# EAGLE design KENDALI POMPA AIR IOT (EAGLE 7.4.0)
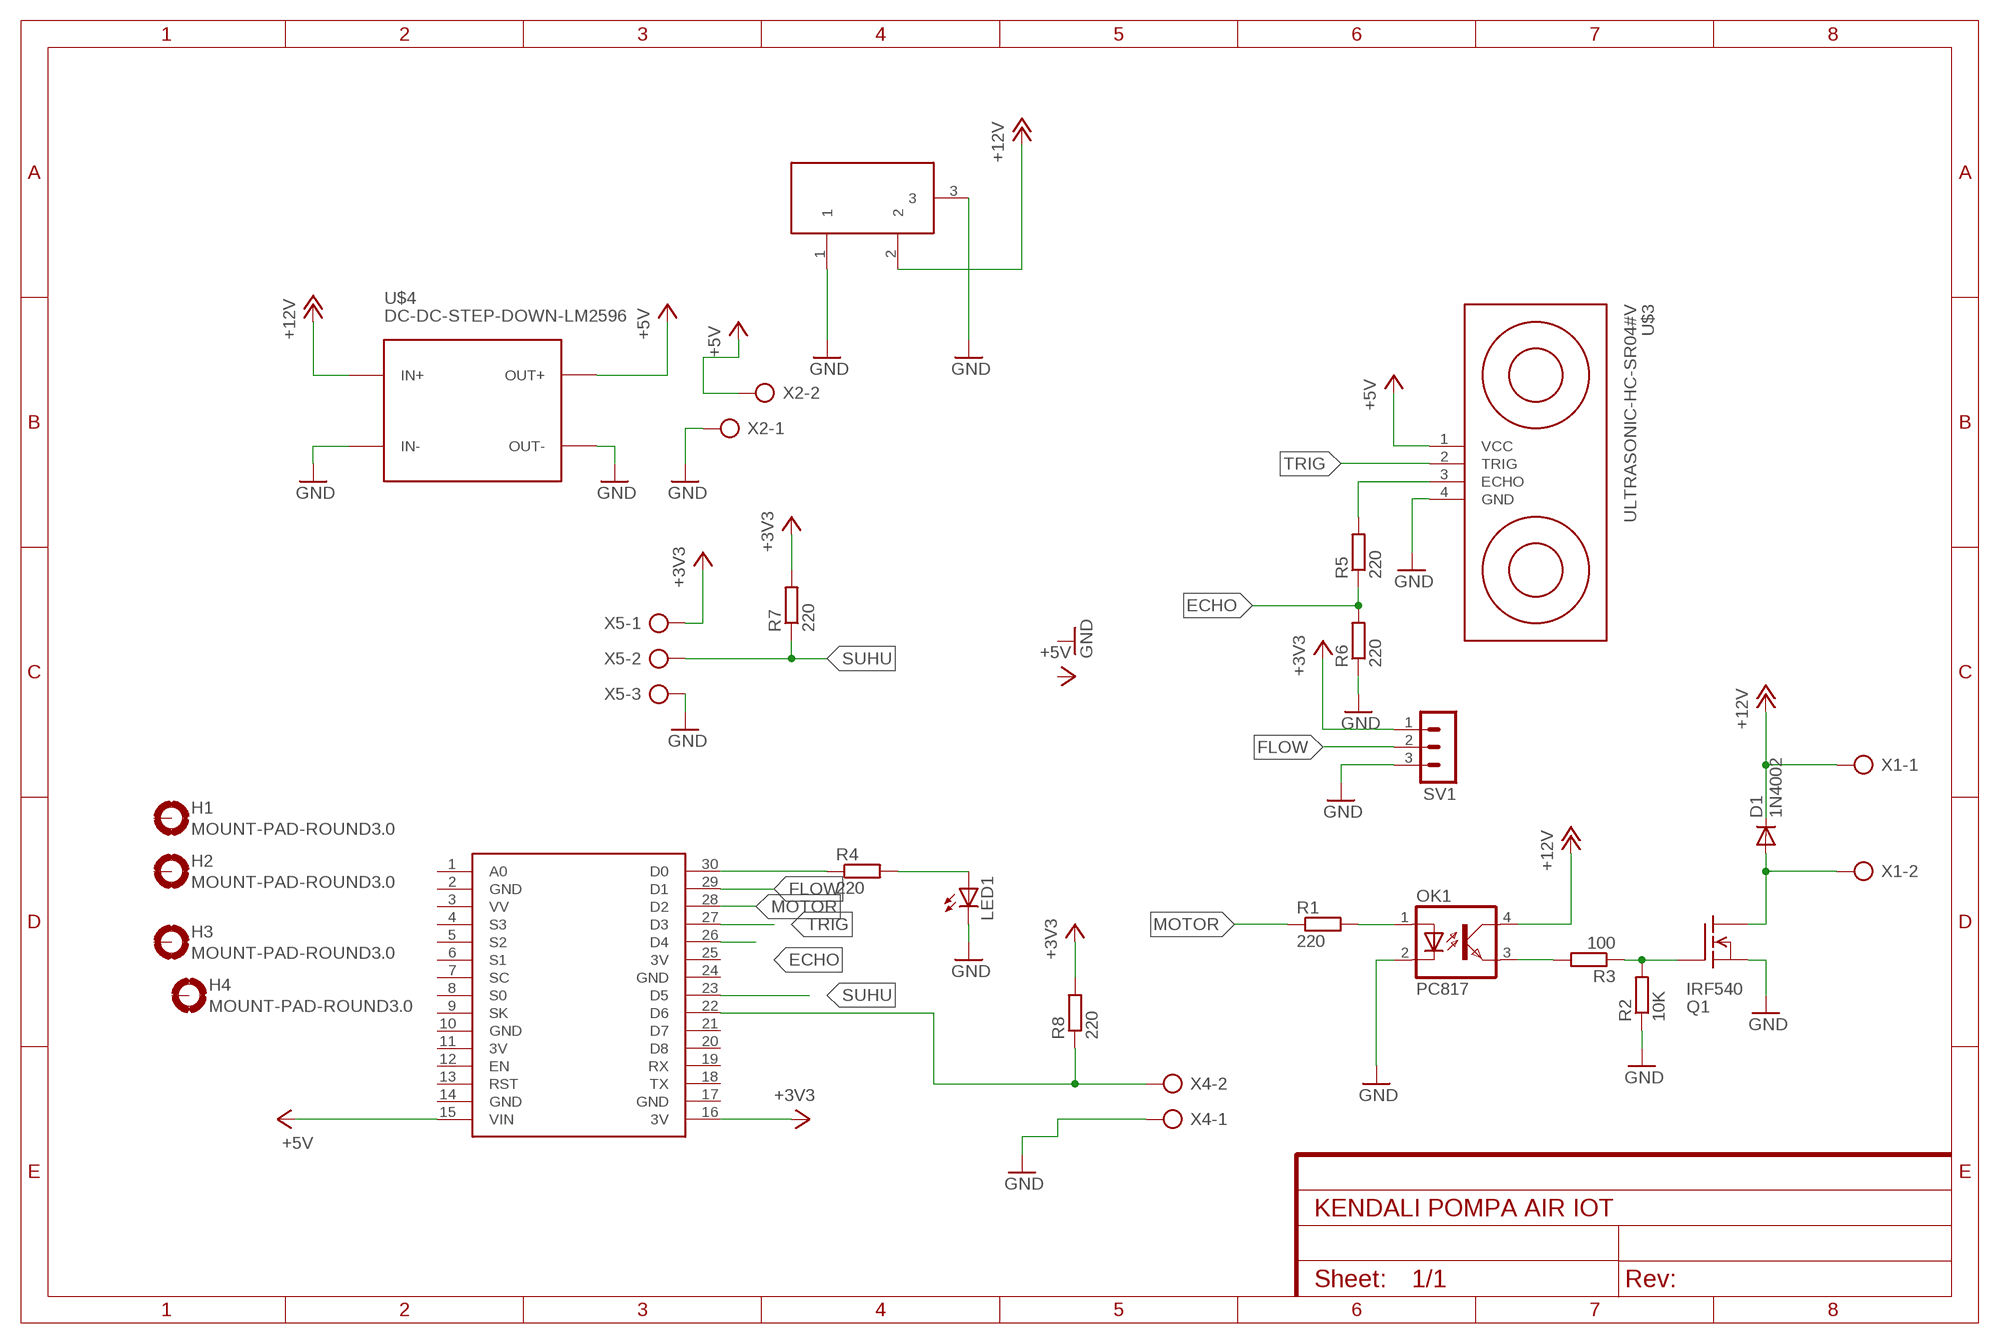
[diagram p0: schematic, sheet 1]

## Parts
D1  1N4002  1N4446  [DO35-10]
H1  MOUNT-PAD-ROUND3.0  [3,0-PAD]
H2  MOUNT-PAD-ROUND3.0  [3,0-PAD]
H3  MOUNT-PAD-ROUND3.0  [3,0-PAD]
H4  MOUNT-PAD-ROUND3.0  [3,0-PAD]
LED1  LED5MM  [LED5MM]
OK1  PC817  [DIL04]
Q1  IRF540  [TO220]
R1  220  R-EU_0207/10  [0207/10]
R2  10K  R-EU_0207/10  [0207/10]
R3  100  R-EU_0207/10  [0207/10]
R4  220  R-EU_0207/10  [0207/10]
R5  220  R-EU_0207/10  [0207/10]
R6  220  R-EU_0207/10  [0207/10]
R7  220  R-EU_0207/10  [0207/10]
R8  220  R-EU_0207/10  [0207/10]
SV1  MA03-1  [MA03-1]
U$1  NODEMCU  [NODEMCU]
U$2  DC21MMX  [DC-21MM]
U$3  ULTRASONIC-HC-SR04#V  [ULTRASONIC-HC-SR04#V]
U$4  DC-DC-STEP-DOWN-LM2596  [DC-DC-STEP-DOWN-LM2596]
X1  AK300/2  [AK300/2]
X2  AK300/2  [AK300/2]
X4  AK300/2  [AK300/2]
X5  AK300/3  [AK300/3]

## Nets
+3V3: R7.2 R8.2 SV1.1 U$1.16(3V) X5.1
+5V: U$1.15(VIN) U$3.1(VCC) U$4.OUT+ X2.2
+12V: D1.C OK1.4(COL) U$2.2 U$4.IN+ X1.1
ECHO: R5.1 R6.2 U$1.26(D4)
FLOW: SV1.2 U$1.29(D1)
GND: LED1.K(C) OK1.2(C) Q1.3(S) R2.1 R6.1 SV1.3 U$2.1 U$2.3 U$3.4(GND) U$4.IN- U$4.OUT- X2.1 X4.1 X5.3
MOTOR: R1.1 U$1.28(D2)
N$1: OK1.3(EMIT) R3.2
N$2: OK1.1(A) R1.2
N$3: Q1.1(G) R2.2 R3.1
N$4: D1.A Q1.2(D) X1.2
N$6: LED1.A R4.2
N$7: R8.1 U$1.22(D6) X4.2
N$10: R4.1 U$1.30(D0)
N$12: R5.2 U$3.3(ECHO)
SUHU: R7.1 U$1.23(D5) X5.2
TRIG: U$1.27(D3) U$3.2(TRIG)
Unconnected: H1.B3,0(MOUNT) H2.B3,0(MOUNT) H3.B3,0(MOUNT) H4.B3,0(MOUNT) U$1.1(A0) U$1.3(VV) U$1.4(S3) U$1.5(S2) U$1.6(S1) U$1.7(SC) U$1.8(S0) U$1.9(SK) U$1.12(EN) U$1.13(RST) U$1.18(TX) U$1.19(RX) U$1.20(D8) U$1.21(D7)

## Power pins joined to a net without a drawn wire
+3V3: U$1.11(3V) U$1.25(3V)
GND: U$1.2(GND) U$1.10(GND) U$1.14(GND) U$1.17(GND) U$1.24(GND)

## Library data of the parts
D1 = diode:1N4446: DIODE high speed (Philips)
H1-H4 = holes:MOUNT-PAD-ROUND: MOUNTING PAD, round
LED1 = led:LED: LED OSRAM: - CHIPLED LG R971, LG N971, LY N971, LG Q971, LY Q971, LO R971, LY R971 LH N974, LH R974 LS Q976, LO Q976, LY Q976 LO Q996 - Hyper CHIPLED LW Q18S LB Q993, LB Q99A, LB R99A - SideLED LS A670, LO A670, LY A670, LG A670, LP A670 LB A673, LV A673, LT A673, LW A673 LH A674 LY A675 LS A676, LA A676, LO A676, LY A676, LW A676 LS A679, LY A679, LG A679 - Hyper Micro SIDELED® LS Y876, LA Y876, LO Y876, LY Y876 LT Y87S - SmartLED LW L88C, LW L88S LB L89C, LB L89S, LG L890 LS L89K, LO L89K, LY L89K LS L896, LA L896, LO L896, LY L896 - TOPLED LS T670, LO T670, LY T670, LG T670, LP T670 LSG T670, LSP T670, LSY T670, LOP T670, LYG T670 LG T671, LOG T671, LSG T671 LB T673, LV T673, LT T673, LW T673 LH T674 LS T676, LA T676, LO T676, LY T676, LB T676, LH T676, LSB T676, LW T676 LB T67C, LV T67C, LT T67C, LS T67K, LO T67K, LY T67K, LW E67C LS E67B, LA E67B, LO E67B, LY E67B, LB E67C, LV E67C, LT E67C LW T67C LS T679, LY T679, LG T679 LS T770, LO T770, LY T770, LG T770, LP T770 LB T773, LV T773, LT T773, LW T773 LH T774 LS E675, LA E675, LY E675, LS T675 LS T776, LA T776, LO T776, LY T776, LB T776 LHGB T686 LT T68C, LB T68C - Hyper Mini TOPLED® LB M676 - Mini TOPLED Santana® LG M470 LS M47K, LO M47K, LY M47K Source: http://www.osram.convergy.de LUXEON: - LUMILED® LXK2-PW12-R00, LXK2-PW12-S00, LXK2-PW14-U00, LXK2-PW14-V00 LXK2-PM12-R00, LXK2-PM12-S00, LXK2-PM14-U00 LXK2-PE12-Q00, LXK2-PE12-R00, LXK2-PE12-S00, LXK2-PE14-T00, LXK2-PE14-U00 LXK2-PB12-K00, LXK2-PB12-L00, LXK2-PB12-M00, LXK2-PB14-N00, LXK2-PB14-P00, LXK2-PB14-Q00 LXK2-PR12-L00, LXK2-PR12-M00, LXK2-PR14-Q00, LXK2-PR14-R00 LXK2-PD12-Q00, LXK2-PD12-R00, LXK2-PD12-S00 LXK2-PH12-R00, LXK2-PH12-S00 LXK2-PL12-P00, LXK2-PL12-Q00, LXK2-PL12-R00 Source: www.luxeon.com KINGBRIGHT: KA-3528ASYC Source: www.kingbright.com
OK1 = optocoupler:PC817: SHARP OPTO COUPLER; MPN: PC817X4J000F; OC_FARNELL: 9707727; OC_NEWARK: 97K7059
Q1 = transistor-fet:IRF540: N-Channel Enhancement MOSFET (HEXFET); 100V; 28A; 0,077Ohm
R1-R8 = rcl:R-EU_: RESISTOR, European symbol
SV1 = con-lstb:MA03-1: PIN HEADER; OC_FARNELL: unknown; OC_NEWARK: unknown
U$1 = nodemcu:NODEMCU
U$2 = powersupply:DC21MM
U$3 = diy-modules:ULTRASONIC-HC-SR04: Ultrasonic Ranging Module HC-SR04 More details available here: http://randomnerdtutorials.com/complete-guide-for-ultrasonic-sensor-hc-sr04/ Click here to find device on ebay.com <http://www.ebay.com/sch/hc+sr04+ultrasonic>
U$4 = diy-modules:DC-DC-STEP-DOWN-LM2596: DC/DC Step-Down Regulator based on LM2596-ADJ chip LM2596 datasheet available here: http://www.ti.com/lit/ds/symlink/lm2596.pdf Click here to find device on ebay.com <http://www.ebay.com/sch/lm2596+power+regulator>
X1 X2 X4 = con-ptr500:AK300/2: CONNECTOR; OC_FARNELL: unknown; OC_NEWARK: unknown
X5 = con-ptr500:AK300/3: CONNECTOR; OC_FARNELL: unknown; OC_NEWARK: unknown

## Board
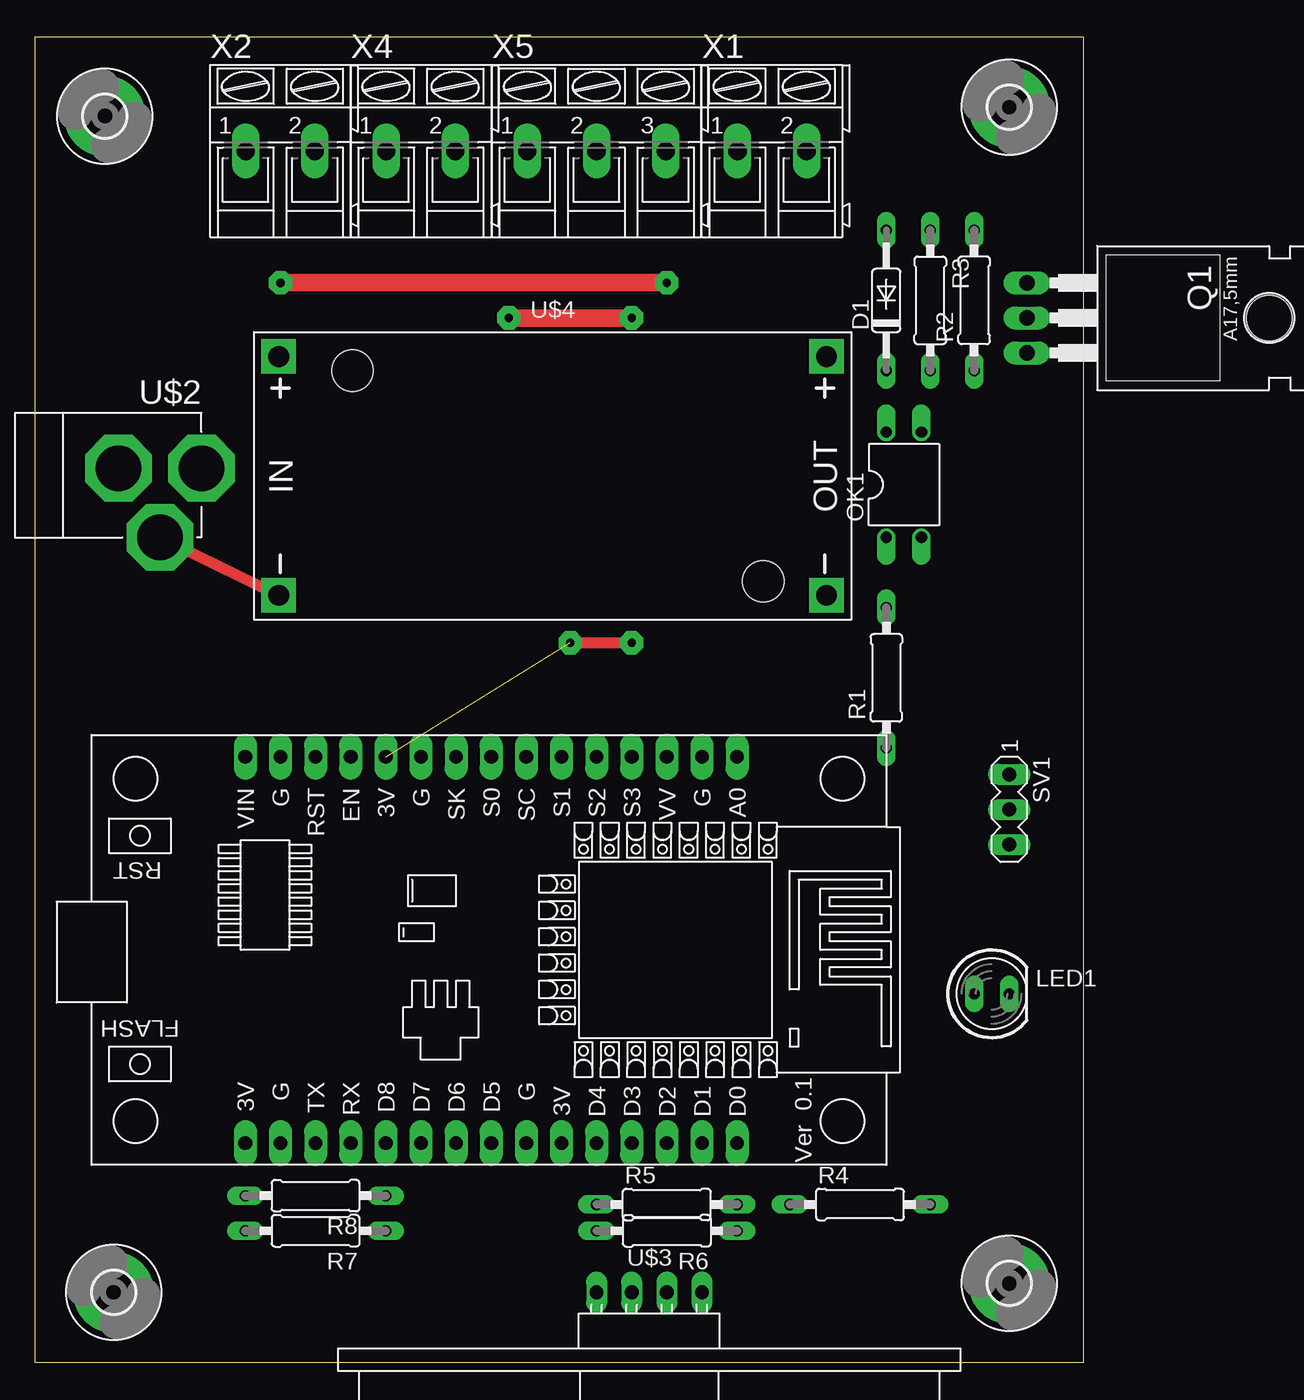
[diagram p1: board, top side]
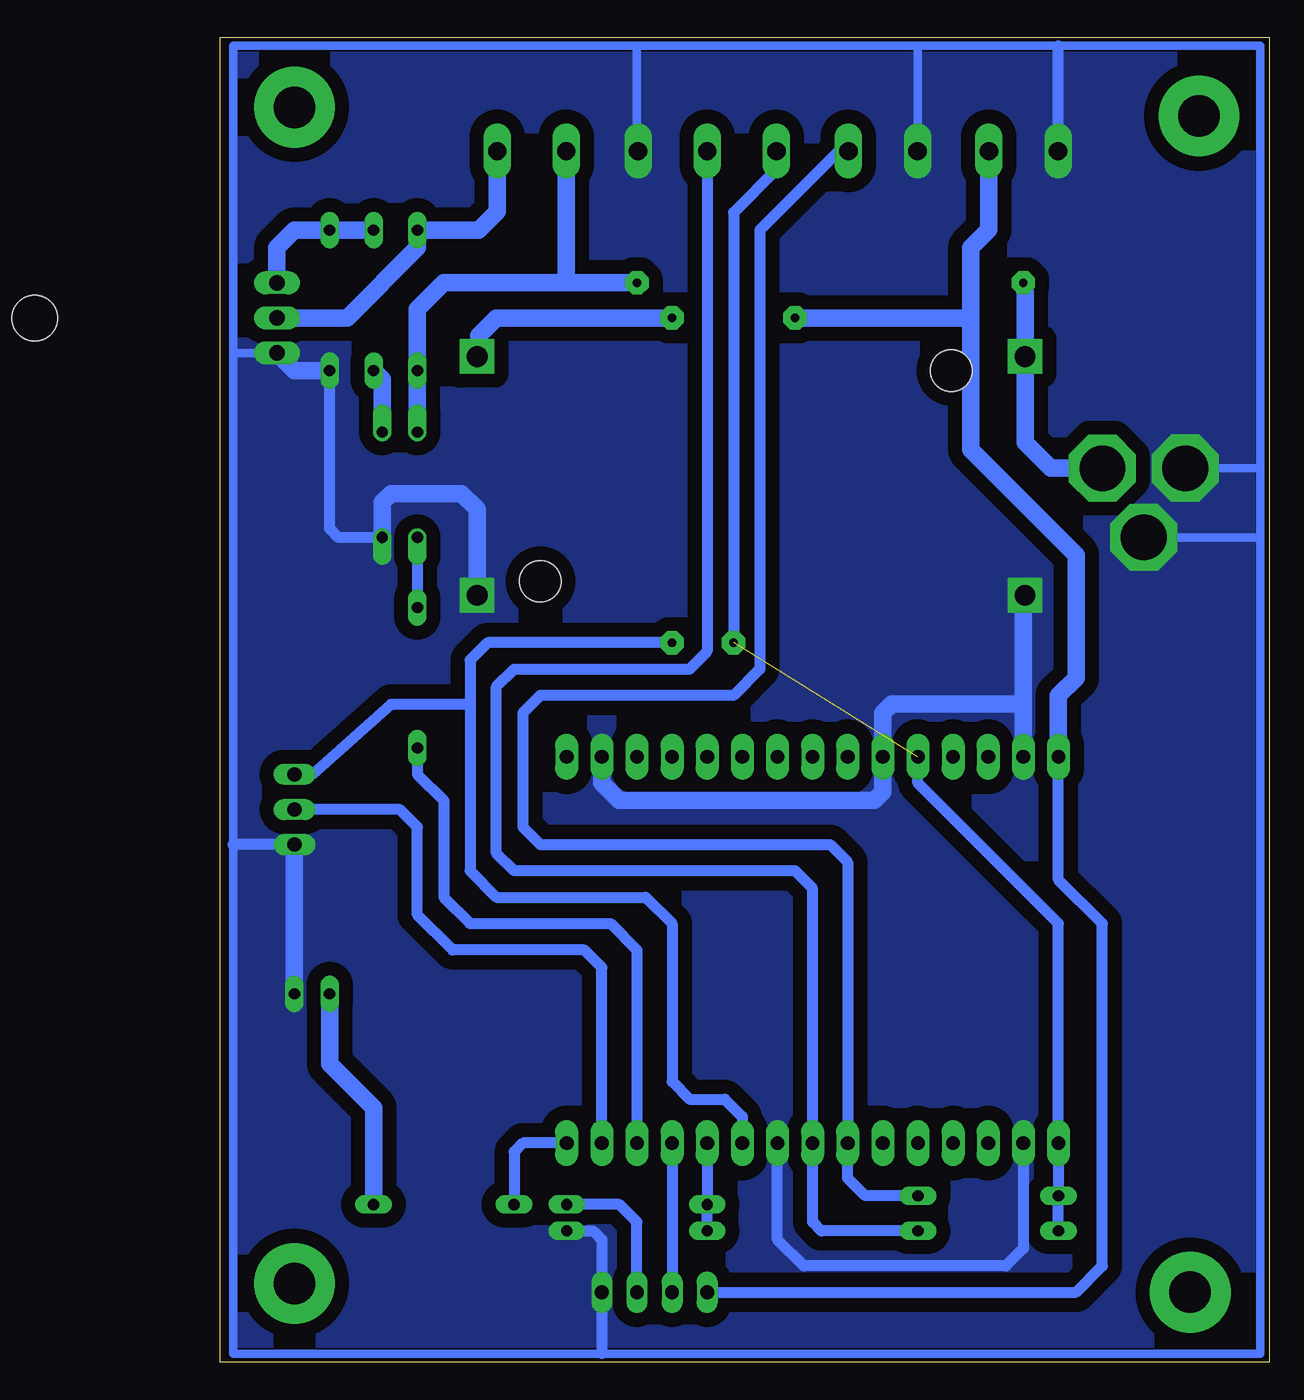
[diagram p2: board, bottom side, seen from below]

Size 75.87 x 95.86 mm. Coordinates in mm from the lower left corner, seen from the top.
Outline: 0,95.86 0,0 75.87,0 75.87,95.86 0,95.86
Copper layers (1*16): Top 0.035mm / dielectric 1.5mm / Bottom 0.035mm
Design rules "default": minimum track width 10mil, minimum drill 24mil, track to track 8mil, track to pad 8mil, pad to pad 8mil, via to via 8mil, smd to smd 8mil, copper to edge 40mil, drill to drill 8mil, minimum pad ring 10mil, minimum via ring 8mil, stop-mask expansion 4mil, vias tented up to drill 0mil, thermal gap 10mil

### Footprints (pad centres in the part's own frame; a part is rotated, then mirrored left to right if it is on the bottom)
DO35-10 = drill 0.813 long: A 5.08,0; C -5.08,0
3,0-PAD = drill 3 pad 5.842: B3,0 0,0
LED5MM = drill 0.813 long: A -1.27,0; K 1.27,0
DIL04 = drill 0.813 offset: 1 -1.27,-3.81; 2 1.27,-3.81; 3 1.27,3.81; 4 -1.27,3.81
TO220 = drill 1.118 long: 1 -2.54,-6.35; 2 0,-6.35; 3 2.54,-6.35 | hole 3.302: 0,11.176
0207/10 = drill 0.813 long: 1 -5.08,0; 2 5.08,0
MA03-1 = drill 1.016 long: 1 -2.54,0; 2 0,0; 3 2.54,0
NODEMCU = drill 1 pad 1.676 long: 1 -13.97,17.78; 2 -13.97,15.24; 3 -13.97,12.7; 4 -13.97,10.16; 5 -13.97,7.62; 6 -13.97,5.08; 7 -13.97,2.54; 8 -13.97,0; 9 -13.97,-2.54; 10 -13.97,-5.08; 11 -13.97,-7.62; 12 -13.97,-10.16; 13 -13.97,-12.7; 14 -13.97,-15.24; 15 -13.97,-17.78; 16 13.97,-17.78; 17 13.97,-15.24; 18 13.97,-12.7; 19 13.97,-10.16; 20 13.97,-7.62; 21 13.97,-5.08; 22 13.97,-2.54; 23 13.97,0; 24 13.97,2.54; 25 13.97,5.08; 26 13.97,7.62; 27 13.97,10.16; 28 13.97,12.7; 29 13.97,15.24; 30 13.97,17.78
DC-21MM = drill 3.302 pad 4.826 octagon: 1 -5.08,-3.353; 2 -0.076,-6.35; 3 -0.076,-0.356
ULTRASONIC-HC-SR04#V = drill 1 long: 1 -3.81,0; 2 -1.27,0; 3 1.27,0; 4 3.81,0
DC-DC-STEP-DOWN-LM2596 = drill 1.5 pad 2.5 square: IN+ -19.812,8.636; IN- -19.812,-8.636; OUT+ 19.812,8.636; OUT- 19.812,-8.636 | hole 3: -14.478,7.62; 15.24,-7.62
AK300/2 = drill 1.321 long: 1 -2.515,0; 2 2.489,0
AK300/3 = drill 1.321 long: 1 -5.004,0; 2 0,0; 3 5.004,0

### Placement (x,y rotation side)
D1  61.59,76.81 90 top
H1  5.71,5.06 270 top
H2  70.48,5.69 270 top
H3  5.08,90.15 270 top
H4  70.48,90.78 270 top
LED1  69.22,26.65 0 top
OK1  62.86,63.48 0 top
Q1  78.11,75.55 270 top
R1  61.59,49.51 90 top
R2  67.94,76.81 90 top
R3  64.77,76.81 270 top
R4  59.69,11.41 0 top
R5  45.72,11.41 0 top
R6  45.72,9.51 180 top
R7  20.32,9.51 180 top
R8  20.32,12.04 180 top
SV1  70.48,39.98 270 top
U$1  33.02,29.82 270 top
U$2  5.71,64.75 90 top
U$3  44.45,5.06 0 top
U$4  37.46,64.11 0 top
X1  53.34,87.61 0 top
X2  17.78,87.61 0 top
X4  27.94,87.61 0 top
X5  40.64,87.61 0 top

### Tracks (layer width: path | path; a pad name or v marks a point on that pad's centre or on a via)
+3V3  (via drill 0.6 pad 1.68)  (1 unrouted)
  Top 0.813: v38.73,52.05 v43.18,52.05
  Bottom 0.813: X5.1 35.64,86.26 38.73,83.16 v38.73,52.05 | R7.2 R8.2 U$1.16 15.24,31.73 25.4,41.89 U$1.11 | U$1.25 38.1,17.76 39.37,19.03 41.91,19.03 43.18,20.3 43.18,31.73 45.08,33.63 55.88,33.63 57.78,35.54 57.78,47.6 | SV1.1 69.22,42.52 63.5,47.6 57.78,47.6 | 57.78,47.6 57.78,50.78 56.52,52.05 v43.18,52.05
+5V  (via drill 0.6 pad 1.68)
  Top 1.27: v43.18,75.55 v34.29,75.55
  Bottom 0.813: U$3.1 13.97,5.06 12.07,6.96 12.07,31.73 15.24,34.91 U$1.15
  Bottom 1.27: X2.2 20.27,81.95 21.59,80.62 21.59,75.55 | 21.59,75.55 21.59,66.02 13.97,58.4 13.97,49.51 15.24,48.24 U$1.15 | v43.18,75.55 55.88,75.55 57.15,74.28 57.15,72.88 U$4.OUT+ | v34.29,75.55 21.59,75.55
+12V  (via drill 0.6 pad 1.68)
  Top 1.27: v17.78,78.08 v45.72,78.08
  Bottom 1.27: U$2.2 15.8,64.67 17.65,66.53 U$4.IN+ 17.65,77.32 v17.78,78.08 | 51.43,78.08 59.69,78.08 61.59,76.18 D1.C OK1.4 | X1.1 50.82,78.11 51.43,78.08 | v45.72,78.08 51.43,78.08
ECHO
  Bottom 0.813: U$1.26 R5.1 R6.2
FLOW
  Bottom 0.813: U$1.29 48.26,28.55 49.53,29.82 59.05,29.82 61.59,32.37 61.59,38.71 62.86,39.98 SV1.2
GND
  Top 0.813: U$4.IN- U$2.1
  Bottom 0.61: Q1.3 74.93,73 | 74.93,73 74.93,95.23 45.72,95.23 | 45.72,95.23 25.4,95.23 | 25.4,95.23 15.24,95.23 0.63,95.23 0.63,64.75 | 0.63,64.75 0.63,59.67 | 0.63,59.67 0.63,0.61 48.26,0.61 74.93,0.61 74.93,37.45 74.93,73 | X4.1 25.4,87.61 25.4,95.23 | X5.3 45.72,87.61 45.72,95.23 | U$2.1 0.63,59.67 | U$2.3 0.71,64.67 0.63,64.75
  Bottom 0.813: 48.26,0.61 U$3.4 48.26,8.87 48.89,9.51 R6.1 | SV1.3 74.93,37.45 | OK1.2 67.31,59.67 67.94,60.3 R2.1 | U$1.17 17.78,8.24 19.05,6.96 33.66,6.96 35.56,8.87 U$1.24 | X2.1 15.27,95.2 15.24,95.23
  Bottom 1.27: R2.1 70.48,71.73 Q1.3 | U$1.14 17.78,47.6 | 17.78,47.6 17.78,55.35 U$4.IN- | U$4.OUT- 57.28,61.7 58.42,62.84 63.5,62.84 64.14,62.21 OK1.2 | LED1.K SV1.3 | U$1.2 48.26,41.89 46.99,40.62 28.57,40.62 27.94,41.25 U$1.10 27.94,46.97 27.3,47.6 17.78,47.6
  pour Bottom (isolate 1.016, no thermals): -1.27,101.58 77.47,101.58 78.74,100.31 78.74,-0.66 78.11,-1.29 -1.27,-1.29 -1.91,-0.66 -1.91,100.94
MOTOR
  Bottom 0.813: R1.1 61.59,42.52 59.69,40.62 59.69,33.63 57.78,31.73 47.62,31.73 45.72,29.82 U$1.28
N$1
  Bottom 1.27: OK1.3 64.14,71.1 R3.2
N$2
  Bottom 0.813: OK1.1 R1.2
N$3
  Bottom 1.27: Q1.1 71.75,80.62 70.48,81.89 R2.2 R3.1
N$4
  Bottom 1.27: Q1.2 66.67,75.55 61.59,80.62 D1.A 57.15,81.89 55.83,83.22 X1.2
N$6
  Bottom 1.27: R4.2 64.77,18.39 67.94,21.57 LED1.A
N$7
  Bottom 0.813: X4.2 31.12,87.61 36.83,81.89 36.83,50.14 38.73,48.24 52.7,48.24 53.97,46.97 53.97,38.71 52.7,37.45 31.75,37.45 30.48,36.17 U$1.22 30.48,13.32 29.21,12.04 R8.1
N$10
  Bottom 0.813: U$1.30 53.97,15.86 54.61,15.22 R4.1
N$12
  Bottom 0.813: U$3.3 45.72,10.14 46.99,11.41 R5.2
SUHU
  Bottom 0.813: X5.2 40.64,51.41 41.91,50.14 54.61,50.14 55.88,48.88 55.88,36.81 54.61,35.54 34.29,35.54 33.02,34.27 U$1.23 33.02,10.14 32.38,9.51 R7.1
TRIG
  Bottom 0.813: U$1.27 U$3.2